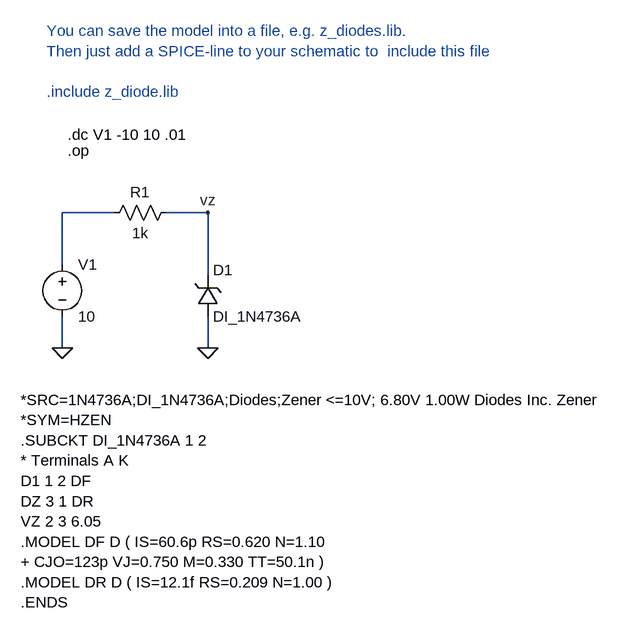
[diagram p0: schematic zd6v8.asc]
zd6v8.asc, the LTspice schematic file:
Version 4
SHEET 1 880 680
WIRE -208 160 -208 80
WIRE -208 288 -208 240
WIRE -128 80 -208 80
WIRE 16 80 -48 80
WIRE 16 176 16 80
WIRE 16 288 16 240
FLAG 16 288 0
FLAG -208 288 0
FLAG 16 80 vz
SYMBOL zener 0 240 M180
WINDOW 0 24 72 Left 0
WINDOW 3 24 0 Left 0
SYMATTR InstName D1
SYMATTR Value DI_1N4736A
SYMATTR Prefix X
SYMBOL voltage -208 144 R0
SYMATTR InstName V1
SYMATTR Value 10
SYMBOL res -144 96 R270
WINDOW 0 32 56 VTop 0
WINDOW 3 0 56 VBottom 0
SYMATTR InstName R1
SYMATTR Value 1k
TEXT -272 368 Left 0 !*SRC=1N4736A;DI_1N4736A;Diodes;Zener <=10V; 6.80V 1.00W Diodes Inc. Zener\n*SYM=HZEN\n.SUBCKT DI_1N4736A 1 2\n* Terminals A K\nD1 1 2 DF\nDZ 3 1 DR\nVZ 2 3 6.05\n.MODEL DF D ( IS=60.6p RS=0.620 N=1.10\n+ CJO=123p VJ=0.750 M=0.330 TT=50.1n )\n.MODEL DR D ( IS=12.1f RS=0.209 N=1.00 )\n.ENDS
TEXT -200 -16 Left 0 !.op
TEXT -200 -40 Left 0 !.dc V1 -10 10 .01
TEXT -232 -200 Left 0 ;You can save the model into a file, e.g. z_diodes.lib.\nThen just add a SPICE-line to your schematic to  include this file\n \n.include z_diode.lib

The netlist it stands for:
* zd6v8.asc
XD1 0 vz DI_1N4736A  ; pins + -
V1 N001 0 10
R1 N001 vz 1k
*SRC=1N4736A;DI_1N4736A;Diodes;Zener <=10V; 6.80V 1.00W Diodes Inc. Zener
*SYM=HZEN
.SUBCKT DI_1N4736A 1 2
* Terminals A K
D1 1 2 DF
DZ 3 1 DR
VZ 2 3 6.05
.MODEL DF D ( IS=60.6p RS=0.620 N=1.10
+ CJO=123p VJ=0.750 M=0.330 TT=50.1n )
.MODEL DR D ( IS=12.1f RS=0.209 N=1.00 )
.ENDS
.op
.dc V1 -10 10 .01
* You can save the model into a file, e.g. z_diodes.lib.
* Then just add a SPICE-line to your schematic to  include this file
* .include z_diode.lib
.backanno
.end